# Altium schematic sheet DEVICE.SchDoc
size A4
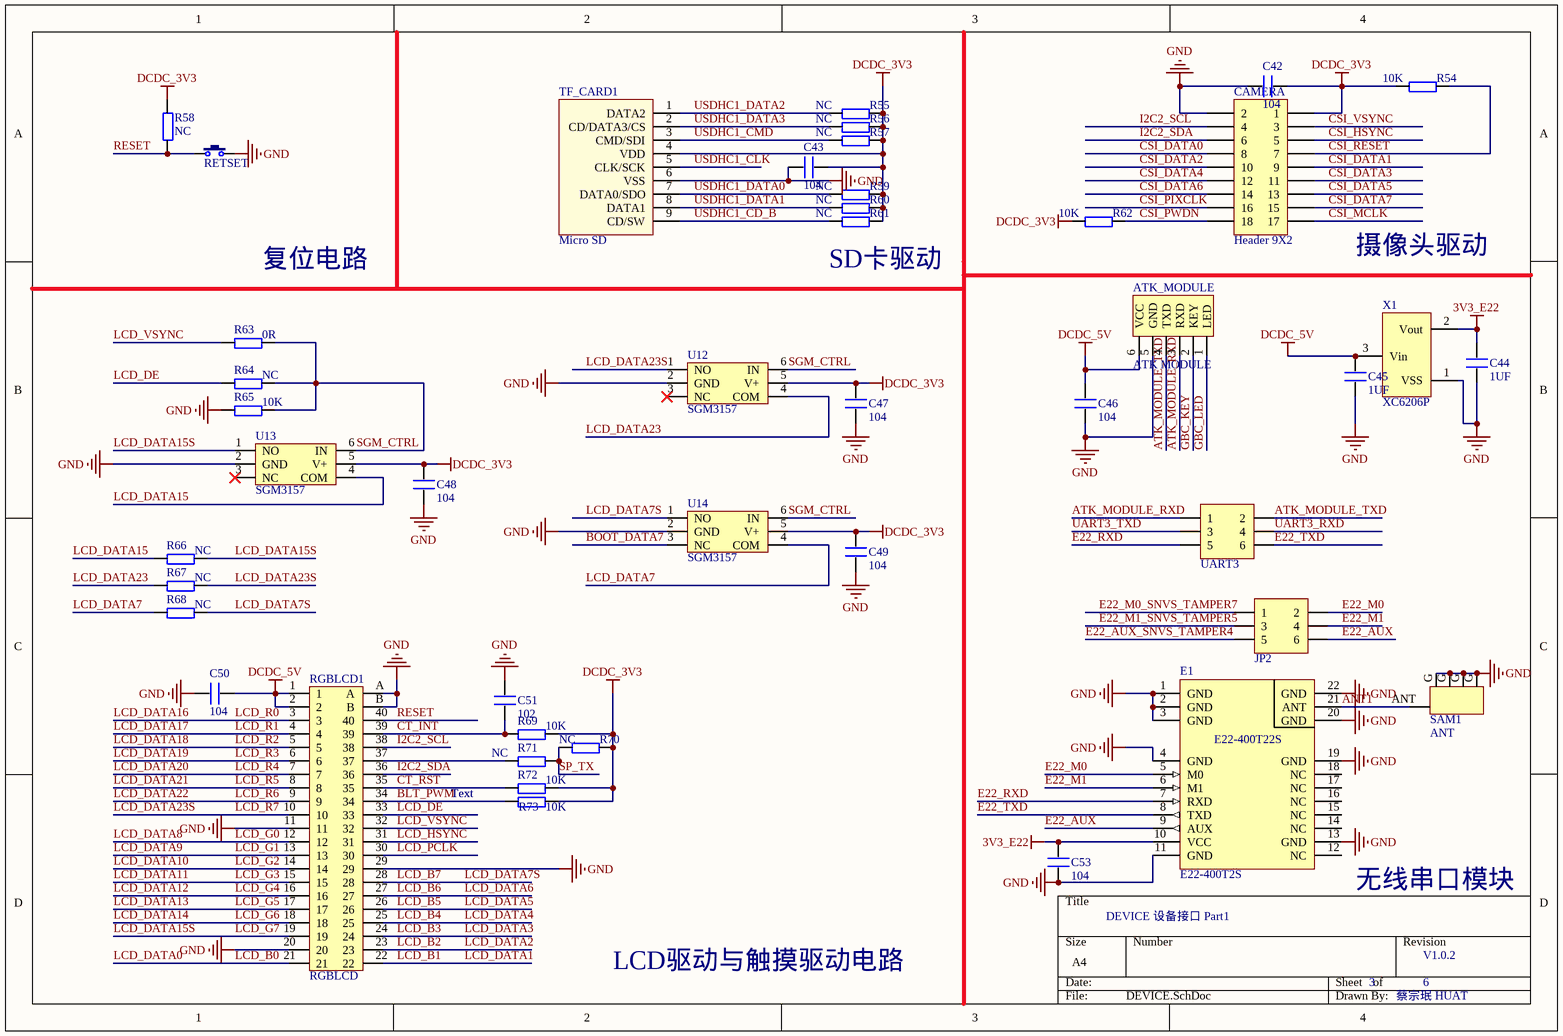
[diagram p0: DEVICE.SchDoc]

## Parts
ATK_MODULE  ATK MODULE  [HEAD6]
C42  104  [C_0603P]
C43  104  [C_0603P]
C44  1UF  [C_0603P]
C45  1UF  [C_0603P]
C46  104  [C_0603P]
C47  104  [C_0603P]
C48  104  [C_0603P]
C49  104  [C_0603P]
C50  104  [C_0603P]
C51  102  [C_0603P]
C53  104  [C_0603P]
CAMERA  Header 9X2  [HDR2X9]
E1  E22-400T2S  [PE22-400T22S]
JP2  RS232/RS485  [HDR-3X2]  (value not drawn)
R54  10K  [R_0603P]
R55  NC  [R_0603P]
R56  NC  [R_0603P]
R57  NC  [R_0603P]
R58  NC  [R_0603P]
R59  NC  [R_0603P]
R60  NC  [R_0603P]
R61  NC  [R_0603P]
R62  10K  [R_0603P]
R63  0R  [R_0603P]
R64  NC  [R_0603P]
R65  10K  [R_0603P]
R66  NC  [R_0603P]
R67  NC  [R_0603P]
R68  NC  [R_0603P]
R69  10K  [R_0603P]
R70  NC  [R_0603P]
R71  NC  [R_0603P]
R72  10K  [R_0603P]
R73  10K  [R_0603P]
RETSET  KEY  [TSW DIP-6*6*5 - 2]  (value not drawn)
RGBLCD1  RGBLCD  [FPC0.5-TOP40P]
SAM1  ANT  [SMA-KE]
TF_CARD1  Micro SD  [Micro SD]
U12  SGM3157  [SOT363-6L]
U13  SGM3157  [SOT363-6L]
U14  SGM3157  [SOT363-6L]
UART3  RS232/RS485  [HDR-3X2]  (value not drawn)
X1  XC6206P  [XC6206P332  SOT-23  LDO电源稳压IC]

## Nets
3V3_E22: C44.2 C53.2 E1.10(VCC) X1.2(Vout)
DCDC_3V3: C42.2 C43.2 C47.2 C48.2 C49.2 CAMERA.1 R54.1 R55.2 R56.2 R57.2 R58.2 R59.2 R60.2 R61.2 R62.1 R69.2 R70.2 R72.2 R73.2 TF_CARD1.4(VDD) U12.5(V+) U13.5(V+) U14.5(V+)
DCDC_5V: ATK_MODULE.6(VCC) C45.2 C46.2 C50.2 RGBLCD1.1 RGBLCD1.2 X1.3(Vin)
GND: ATK_MODULE.5(GND) C42.1 C43.1 C44.1 C45.1 C46.1 C47.1 C48.1 C49.1 C50.1 C51.2 C53.1 CAMERA.2 E1.1(GND) E1.2(GND) E1.3(GND) E1.4(GND) E1.11(GND) E1.13(GND) E1.19(GND) E1.20(GND) E1.22(GND) R65.1 RETSET.2 RGBLCD1.11 RGBLCD1.20 RGBLCD1.29 RGBLCD1.A RGBLCD1.B SAM1.G TF_CARD1.6(VSS) U12.2(GND) U13.2(GND) U14.2(GND) X1.1(VSS)
ANT1: E1.21(ANT) SAM1.ANT
ATK_MODULE_RXD: ATK_MODULE.3(RXD) UART3.1
ATK_MODULE_TXD: ATK_MODULE.4(TXD) UART3.2
BLT_PWM: R73.1 RGBLCD1.34
BOOT_DATA7: U14.3(NC)
CSI_DATA0: CAMERA.8
CSI_DATA1: CAMERA.9
CSI_DATA2: CAMERA.10
CSI_DATA3: CAMERA.11
CSI_DATA4: CAMERA.12
CSI_DATA5: CAMERA.13
CSI_DATA6: CAMERA.14
CSI_DATA7: CAMERA.15
CSI_HSYNC: CAMERA.5
CSI_MCLK: CAMERA.17
CSI_PIXCLK: CAMERA.16
CSI_PWDN: CAMERA.18 R62.2
CSI_RESET: CAMERA.7 R54.2
CSI_VSYNC: CAMERA.3
CT_INT: C51.1 R69.1 RGBLCD1.39
CT_RST: R72.1 RGBLCD1.35
E22_AUX: E1.9(AUX) JP2.6
E22_AUX_SNVS_TAMPER4: JP2.5
E22_M0: E1.5(M0) JP2.2
E22_M0_SNVS_TAMPER7: JP2.1
E22_M1: E1.6(M1) JP2.4
E22_M1_SNVS_TAMPER5: JP2.3
E22_RXD: E1.7(RXD) UART3.5
E22_TXD: E1.8(TXD) UART3.6
GBC_KEY: ATK_MODULE.2(KEY)
GBC_LED: ATK_MODULE.1(LED)
I2C2_SCL: CAMERA.4 RGBLCD1.38
I2C2_SDA: CAMERA.6 RGBLCD1.36
LCD_B0: RGBLCD1.21  [also labelled LCD_DATA0]
LCD_B1: RGBLCD1.22  [also labelled LCD_DATA1]
LCD_B2: RGBLCD1.23  [also labelled LCD_DATA2]
LCD_B3: RGBLCD1.24  [also labelled LCD_DATA3]
LCD_B4: RGBLCD1.25  [also labelled LCD_DATA4]
LCD_B5: RGBLCD1.26  [also labelled LCD_DATA5]
LCD_B6: RGBLCD1.27  [also labelled LCD_DATA6]
LCD_B7: R68.2 RGBLCD1.28 U14.1(NO)  [also labelled LCD_DATA7S]
LCD_DATA7: R68.1 U14.4(COM)
LCD_DATA8: RGBLCD1.12  [also labelled LCD_G0]
LCD_DATA9: RGBLCD1.13  [also labelled LCD_G1]
LCD_DATA10: RGBLCD1.14  [also labelled LCD_G2]
LCD_DATA11: RGBLCD1.15  [also labelled LCD_G3]
LCD_DATA12: RGBLCD1.16  [also labelled LCD_G4]
LCD_DATA13: RGBLCD1.17  [also labelled LCD_G5]
LCD_DATA14: RGBLCD1.18  [also labelled LCD_G6]
LCD_DATA15: R66.1 U13.4(COM)
LCD_DATA15S: R66.2 RGBLCD1.19 U13.1(NO)  [also labelled LCD_G7]
LCD_DATA16: RGBLCD1.3  [also labelled LCD_R0]
LCD_DATA17: RGBLCD1.4  [also labelled LCD_R1]
LCD_DATA18: RGBLCD1.5  [also labelled LCD_R2]
LCD_DATA19: RGBLCD1.6  [also labelled LCD_R3]
LCD_DATA20: RGBLCD1.7  [also labelled LCD_R4]
LCD_DATA21: RGBLCD1.8  [also labelled LCD_R5]
LCD_DATA22: RGBLCD1.9  [also labelled LCD_R6]
LCD_DATA23: R67.1 U12.4(COM)
LCD_DATA23S: R67.2 RGBLCD1.10 U12.1(NO)  [also labelled LCD_R7]
LCD_DE: R64.1 RGBLCD1.33
LCD_HSYNC: RGBLCD1.31
LCD_PCLK: RGBLCD1.30
LCD_VSYNC: R63.1 RGBLCD1.32
RESET: R58.1 RETSET.1 RGBLCD1.40
SGM_CTRL: R63.2 R64.2 R65.2 U12.6(IN) U13.6(IN) U14.6(IN)
SP_TX: R70.1 R71.2
UART3_RXD: UART3.4
UART3_TXD: UART3.3
USDHC1_CD_B: R61.1 TF_CARD1.9(CD/SW)
USDHC1_CLK: TF_CARD1.5(CLK/SCK)
USDHC1_CMD: R57.1 TF_CARD1.3(CMD/SDI)
USDHC1_DATA0: R59.1 TF_CARD1.7(DATA0/SDO)
USDHC1_DATA1: R60.1 TF_CARD1.8(DATA1)
USDHC1_DATA2: R55.1 TF_CARD1.1(DATA2)
USDHC1_DATA3: R56.1 TF_CARD1.2(CD/DATA3/CS)
NetR71_1: R71.1 RGBLCD1.37

Not connected (* = marked no-connect by the designer): E1 12(NC) 14(NC) 15(NC) 16(NC) 17(NC) 18(NC); U12 3(NC)*; U13 3(NC)*

## Notes on the sheet
- 复位电路
- SD卡驱动
- 摄像头驱动
- Text
- DEVICE 设备接口 Part1
- (near E1) 无线串口模块
- LCD驱动与触摸驱动电路
- 3
- 6
- V1.0.2
- 蔡宗珉 HUAT
- (in symbol E22-400T2S) E22-400T22S

## Library data of the parts
ATK_MODULE = ATK-HC05
C42-C51 C53 = C
CAMERA = Header 9X2: Header, 9-Pin, Dual row; LatestRevisionDate: 17-Jul-2002; LatestRevisionNote: Re-released for DXP Platform.; Publisher: Altium Limited
JP2 UART3 = Header 3X2: 3*2P接插件; 版权归属: 源创客; BOM名称: 3*2P接插件; 学习资源: www.ooocke.com
R54-R73 = R
RETSET = KEY: 按键; BOM名称: 3x6轻触开关; 版权归属: 源创客; 学习资源: www.ooocke.com
RGBLCD1 = FPC-40: FPC-40P-0.5mm
SAM1 = SAM-DIP 天线座
TF_CARD1 = Micro SD: Micro SD卡; 版权归属: 源创客; BOM名称: Micro SD卡; 学习资源: www.ooocke.com
U12-U14 = SGM3157: 单路双掷模拟开关
X1 = XC6206P-332 稳压LDO芯片